# Altium schematic sheet powerswitch.SchDoc
size B
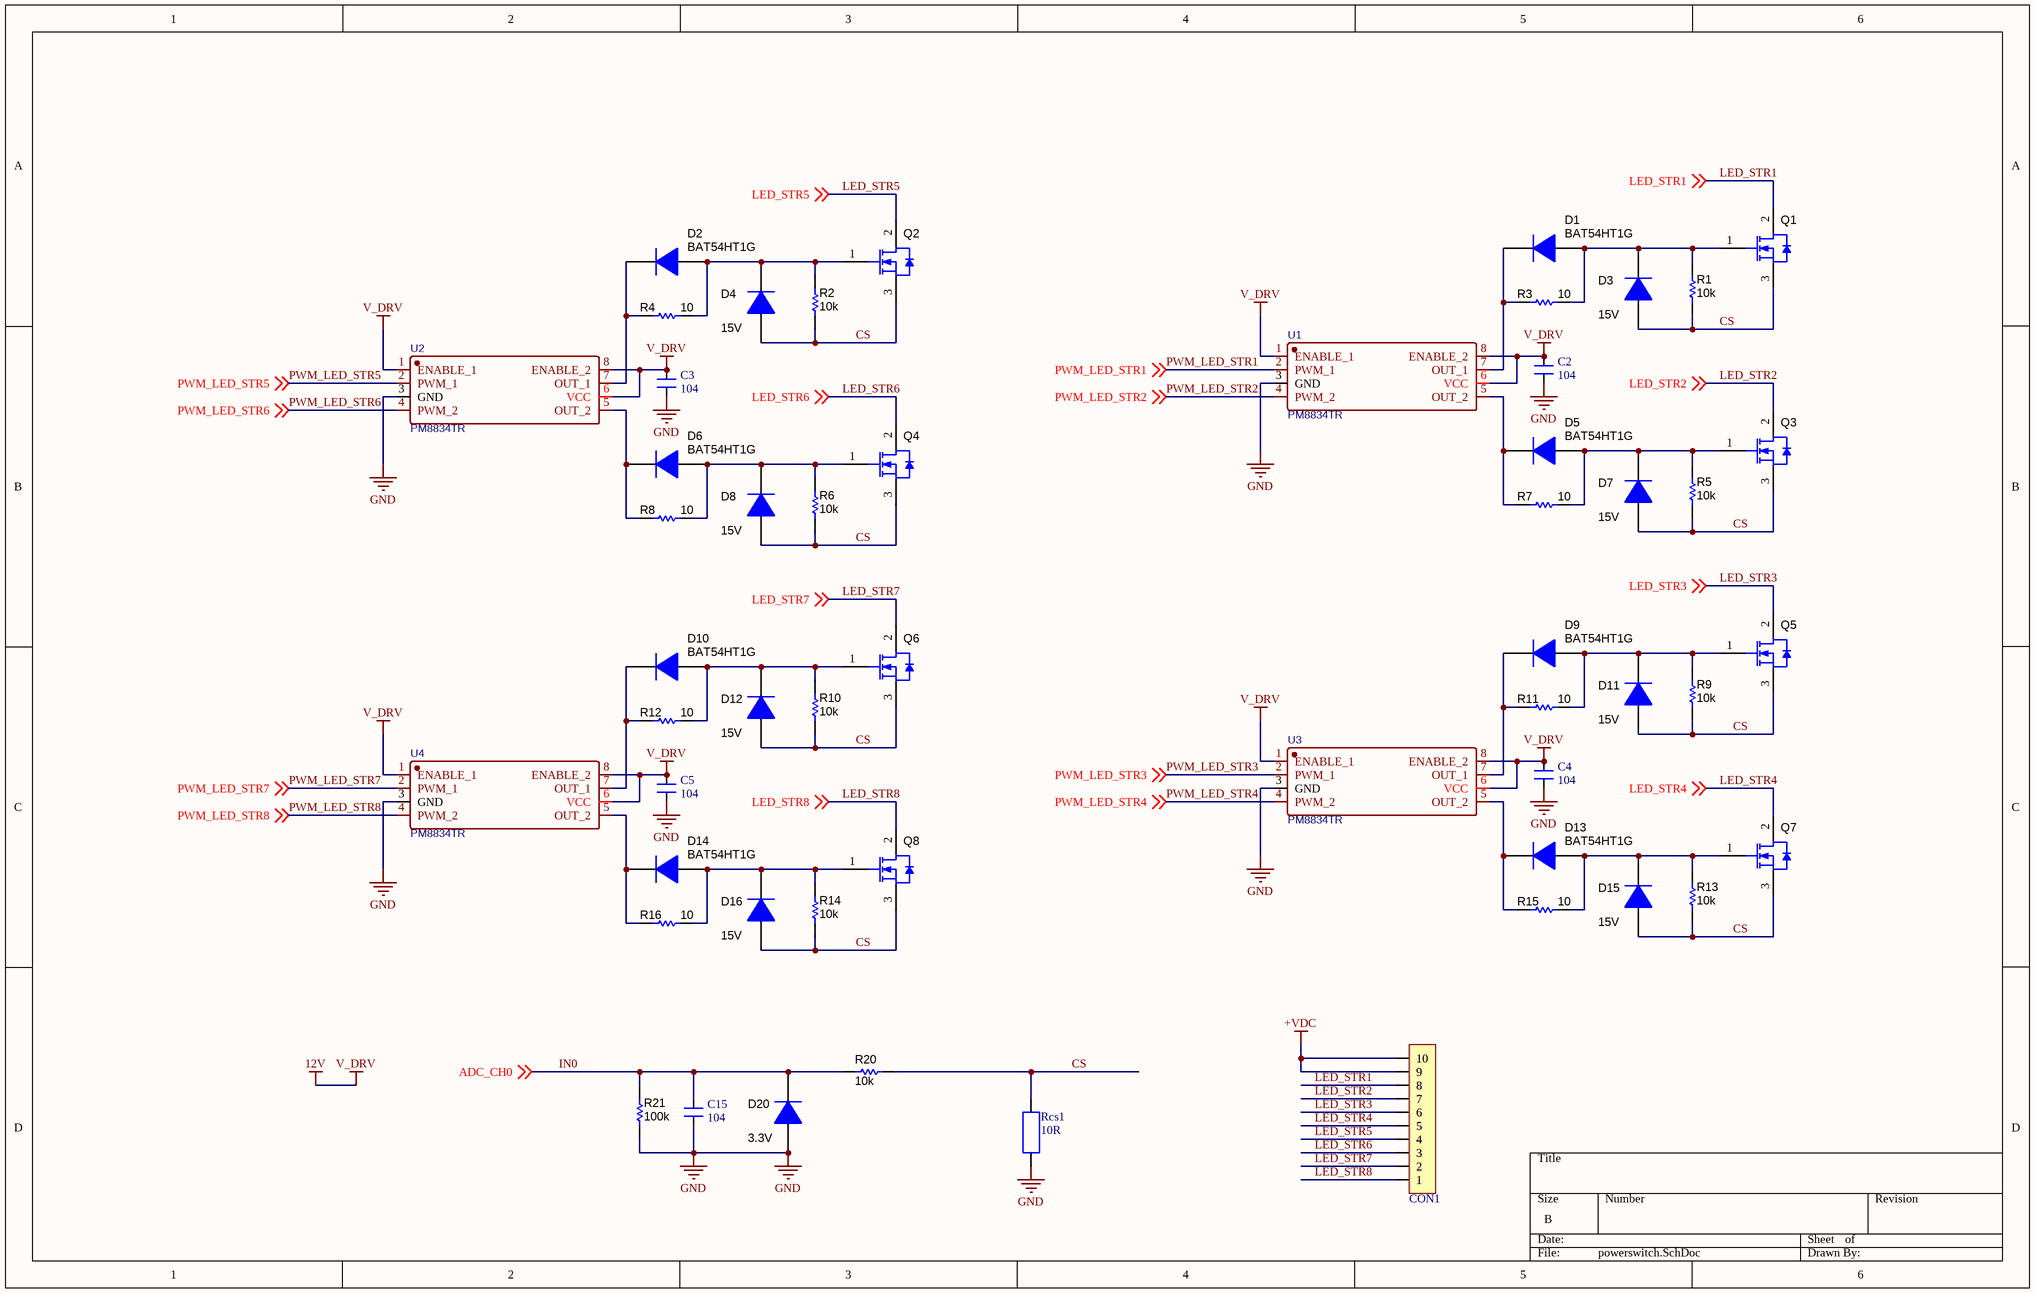
[diagram p0: powerswitch.SchDoc]

## Parts
C2  104  [0805_HV]
C3  104  [0805_HV]
C4  104  [0805_HV]
C5  104  [0805_HV]
C15  104  [0805_HV]
CON1  CON 10 EDG 5.08_MH  [Con 10 EDG 5.08]  (value not drawn)
D1  BAT54HT1G  [SOD-323]
D2  BAT54HT1G  [SOD-323]
D3  15V  [SOD-323]
D4  15V  [SOD-323]
D5  BAT54HT1G  [SOD-323]
D6  BAT54HT1G  [SOD-323]
D7  15V  [SOD-323]
D8  15V  [SOD-323]
D9  BAT54HT1G  [SOD-323]
D10  BAT54HT1G  [SOD-323]
D11  15V  [SOD-323]
D12  15V  [SOD-323]
D13  BAT54HT1G  [SOD-323]
D14  BAT54HT1G  [SOD-323]
D15  15V  [SOD-323]
D16  15V  [SOD-323]
D20  3.3V  [SOD-323]
Q1  IPA60R330P  [TO-220AB_NH]  (value not drawn)
Q2  IPA60R330P  [TO-220AB_NH]  (value not drawn)
Q3  IPA60R330P  [TO-220AB_NH]  (value not drawn)
Q4  IPA60R330P  [TO-220AB_NH]  (value not drawn)
Q5  IPA60R330P  [TO-220AB_NH]  (value not drawn)
Q6  IPA60R330P  [TO-220AB_NH]  (value not drawn)
Q7  IPA60R330P  [TO-220AB_NH]  (value not drawn)
Q8  IPA60R330P  [TO-220AB_NH]  (value not drawn)
R1  10k  [Tro SMD 0805]
R2  10k  [Tro SMD 0805]
R3  10  [Tro SMD 0805]
R4  10  [Tro SMD 0805]
R5  10k  [Tro SMD 0805]
R6  10k  [Tro SMD 0805]
R7  10  [Tro SMD 0805]
R8  10  [Tro SMD 0805]
R9  10k  [Tro SMD 0805]
R10  10k  [Tro SMD 0805]
R11  10  [Tro SMD 0805]
R12  10  [Tro SMD 0805]
R13  10k  [Tro SMD 0805]
R14  10k  [Tro SMD 0805]
R15  10  [Tro SMD 0805]
R16  10  [Tro SMD 0805]
R20  10k  [Tro SMD 0805]
R21  100k  [Tro SMD 0805]
Rcs1  10R  [TRO_VACH_2W]
U1  PM8834TR  [SOP 8]
U2  PM8834TR  [SOP 8]
U3  PM8834TR  [SOP 8]
U4  PM8834TR  [SOP 8]

## Nets
12V: C2.2 C3.2 C4.2 C5.2 U1.1(ENABLE_1) U1.6(VCC) U1.8(ENABLE_2) U2.1(ENABLE_1) U2.6(VCC) U2.8(ENABLE_2) U3.1(ENABLE_1) U3.6(VCC) U3.8(ENABLE_2) U4.1(ENABLE_1) U4.6(VCC) U4.8(ENABLE_2)  [also labelled V_DRV]
+VDC: CON1.9 CON1.10
GND: C2.1 C3.1 C4.1 C5.1 C15.1 D20.2(A) R21.2 Rcs1.1 U1.3(GND) U2.3(GND) U3.3(GND) U4.3(GND)
CS: D3.2(A) D4.2(A) D7.2(A) D8.2(A) D11.2(A) D12.2(A) D15.2(A) D16.2(A) Q1.3(S) Q2.3(S) Q3.3(S) Q4.3(S) Q5.3(S) Q6.3(S) Q7.3(S) Q8.3(S) R1.2 R2.2 R5.2 R6.2 R9.2 R10.2 R13.2 R14.2 R20.2 Rcs1.2
IN0: C15.2 D20.1(K) R20.1 R21.1 ; off-sheet ADC_CH0  [also labelled ADC_CH0]
LED_STR1: CON1.8 Q1.2(D) ; off-sheet LED_STR1
LED_STR2: CON1.7 Q3.2(D) ; off-sheet LED_STR2
LED_STR3: CON1.6 Q5.2(D) ; off-sheet LED_STR3
LED_STR4: CON1.5 Q7.2(D) ; off-sheet LED_STR4
LED_STR5: CON1.4 Q2.2(D) ; off-sheet LED_STR5
LED_STR6: CON1.3 Q4.2(D) ; off-sheet LED_STR6
LED_STR7: CON1.2 Q6.2(D) ; off-sheet LED_STR7
LED_STR8: CON1.1 Q8.2(D) ; off-sheet LED_STR8
PWM_LED_STR1: U1.2(PWM_1) ; off-sheet PWM_LED_STR1
PWM_LED_STR2: U1.4(PWM_2) ; off-sheet PWM_LED_STR2
PWM_LED_STR3: U3.2(PWM_1) ; off-sheet PWM_LED_STR3
PWM_LED_STR4: U3.4(PWM_2) ; off-sheet PWM_LED_STR4
PWM_LED_STR5: U2.2(PWM_1) ; off-sheet PWM_LED_STR5
PWM_LED_STR6: U2.4(PWM_2) ; off-sheet PWM_LED_STR6
PWM_LED_STR7: U4.2(PWM_1) ; off-sheet PWM_LED_STR7
PWM_LED_STR8: U4.4(PWM_2) ; off-sheet PWM_LED_STR8
NetD1_1: D1.1(K) R3.2 U1.7(OUT_1)
NetD1_2: D1.2(A) D3.1(K) Q1.1(G) R1.1 R3.1
NetD2_1: D2.1(K) R4.2 U2.7(OUT_1)
NetD2_2: D2.2(A) D4.1(K) Q2.1(G) R2.1 R4.1
NetD5_1: D5.1(K) R7.2 U1.5(OUT_2)
NetD5_2: D5.2(A) D7.1(K) Q3.1(G) R5.1 R7.1
NetD6_1: D6.1(K) R8.2 U2.5(OUT_2)
NetD6_2: D6.2(A) D8.1(K) Q4.1(G) R6.1 R8.1
NetD9_1: D9.1(K) R11.2 U3.7(OUT_1)
NetD9_2: D9.2(A) D11.1(K) Q5.1(G) R9.1 R11.1
NetD10_1: D10.1(K) R12.2 U4.7(OUT_1)
NetD10_2: D10.2(A) D12.1(K) Q6.1(G) R10.1 R12.1
NetD13_1: D13.1(K) R15.2 U3.5(OUT_2)
NetD13_2: D13.2(A) D15.1(K) Q7.1(G) R13.1 R15.1
NetD14_1: D14.1(K) R16.2 U4.5(OUT_2)
NetD14_2: D14.2(A) D16.1(K) Q8.1(G) R14.1 R16.1

## Library data of the parts
C2-C5 C15 = CM: Cap SMD; Value: 103
CON1 = CON 10 EDG 5.08_MH: CON 10 EDG 5.08 (xanh cong)
D1 D2 D5 D6 D9 D10 D13 D14 = MMDL914-TP: Diode, Switching, 100 V, 0.2 A, SOD-323; Manufacturer: Micro Commercial Components; U/M: EA; Vf_V: 1; Value: 100V; Value1: 0.2A; Value2: 1V; Io_A: 0.2; Vr_V: 100; TJmax_C: 150; SizeAreaWB_mm2: 8.695; SizeArea_mm2: 3.645; SizeX_mm: 2.7; SizeY_mm: 1.35; AEC Category: Q101; SymbolVersion: 2008-12-08; PartNumber: BAT54HT1G; PackageReference: SOD-323; CompType: Diode; MountType: SMT; Type: Switching; RoHS: Y; SizeZ_mm: 1; Published: 2008-06-26; Publisher: Texas Instruments; LatestRevisionDate: 2016-10-18; ComponentLink1Description: Datasheet link; ComponentLink1URL: http://www.mccsemi.com/up_pdf/MMDL914(SOD-323).pdf; Supplier 1: Digi-Key; Supplier Part Number 1: MMDL914-TPMSCT-ND; AEC Qualified: ?
D3 D4 D7 D8 D11 D12 D15 D16 D20 = MMDL914-TP: Diode, Switching, 100 V, 0.2 A, SOD-323; PartNumber: BAV21W-7-F; Manufacturer: Micro Commercial Components; U/M: EA; Vf_V: 1; Value: 100V; Value1: 0.2A; Value2: 1V; Io_A: 0.2; Vr_V: 100; TJmax_C: 150; SizeAreaWB_mm2: 8.695; SizeArea_mm2: 3.645; SizeX_mm: 2.7; SizeY_mm: 1.35; AEC Category: Q101; SymbolVersion: 2008-12-08; PackageReference: SOD-323; CompType: Diode; MountType: SMT; Type: Switching; RoHS: Y; SizeZ_mm: 1; Published: 2008-06-26; Publisher: Texas Instruments; LatestRevisionDate: 2016-10-18; ComponentLink1Description: Datasheet link; ComponentLink1URL: http://www.mccsemi.com/up_pdf/MMDL914(SOD-323).pdf; Supplier 1: Digi-Key; Supplier Part Number 1: MMDL914-TPMSCT-ND; AEC Qualified: ?
Q1-Q8 = IPP60R190P6: MOSFET N-CH 600V 10.6A TO220; PartNumber: IPA60R330P6XKSA1; Manufacturer: Infineon Technologies; SymbolCreator: x0199378; SymbolVersion: 2015-04-01; CompType: MOSFET; Value: 600 V; RoHS: Y; MountType: TH; ComponentLink1Description: Datasheet link; ComponentLink1URL: http://www.infineon.com/dgdl/Infineon-IPX60R330P6-DS-v02_02-EN.pdf?fileId=db3a3043416e106e01416e6a5f240149; Supplier Part Number 1: IPA60R330P6XKSA1-ND; Supplier 1: Digikey; Part Used: IPA60R330P
R1-R16 R20 R21 = R nho: RES, 100, 1%, 0.1 W, 0402; PartNumber: ERJ-2RKF1000X; Manufacturer: Panasonic; CompType: Resistor; Res_ohm: 100; Value_Code: 100R; Tolerance_%: 1; Power_W: 0.1; Value2: 0.1W; VDC_V: 50; TempCo: 100 ppm/C; EIA_Code: E96; U/M: EA; AEC Category: Q200; SymbolVersion: 2009-05-29; PackageReference: 0402; RoHS: Y; Value1: 1%; MountType: SMT; Technology: Thick Film; Published: 2008-06-26; Publisher: Texas Instruments; LatestRevisionDate: 2016-01-08; ComponentLink1Description: Datasheet link; ComponentLink1URL: http://industrial.panasonic.com/www-data/pdf/AOA0000/AOA0000CE2.pdf; Supplier 1: Digi-Key; Supplier Part Number 1: P100LCT-ND; Supplier 2: Mouser; Supplier Part Number 2: 667-ERJ-2RKF1000X; Supplier 3: Farnell; Supplier Part Number 3: 2304034; AEC Qualified: ?
  R1 R2 R5 R6 R9 R10 R13 R14 R20: Value: 10k
  R3 R4 R7 R8 R11 R12 R15 R16: Value: 10
  R21: Value: 100k
Rcs1 = TRO_CS_2W_MH: Value: V?
U1-U4 = PM8834TR: BOM_Manufacturer: STMicroelectronics; Contributor: LCSC; BOM_Supplier: LCSC; BOM_Supplier Part: C221495; BOM_Manufacturer Part: PM8834TR; spicePre: U